# Altium schematic sheet TOP_LEVEL.SchDoc
size 594 x 420 mm; SheetNumber: 1; SheetTotal: 20
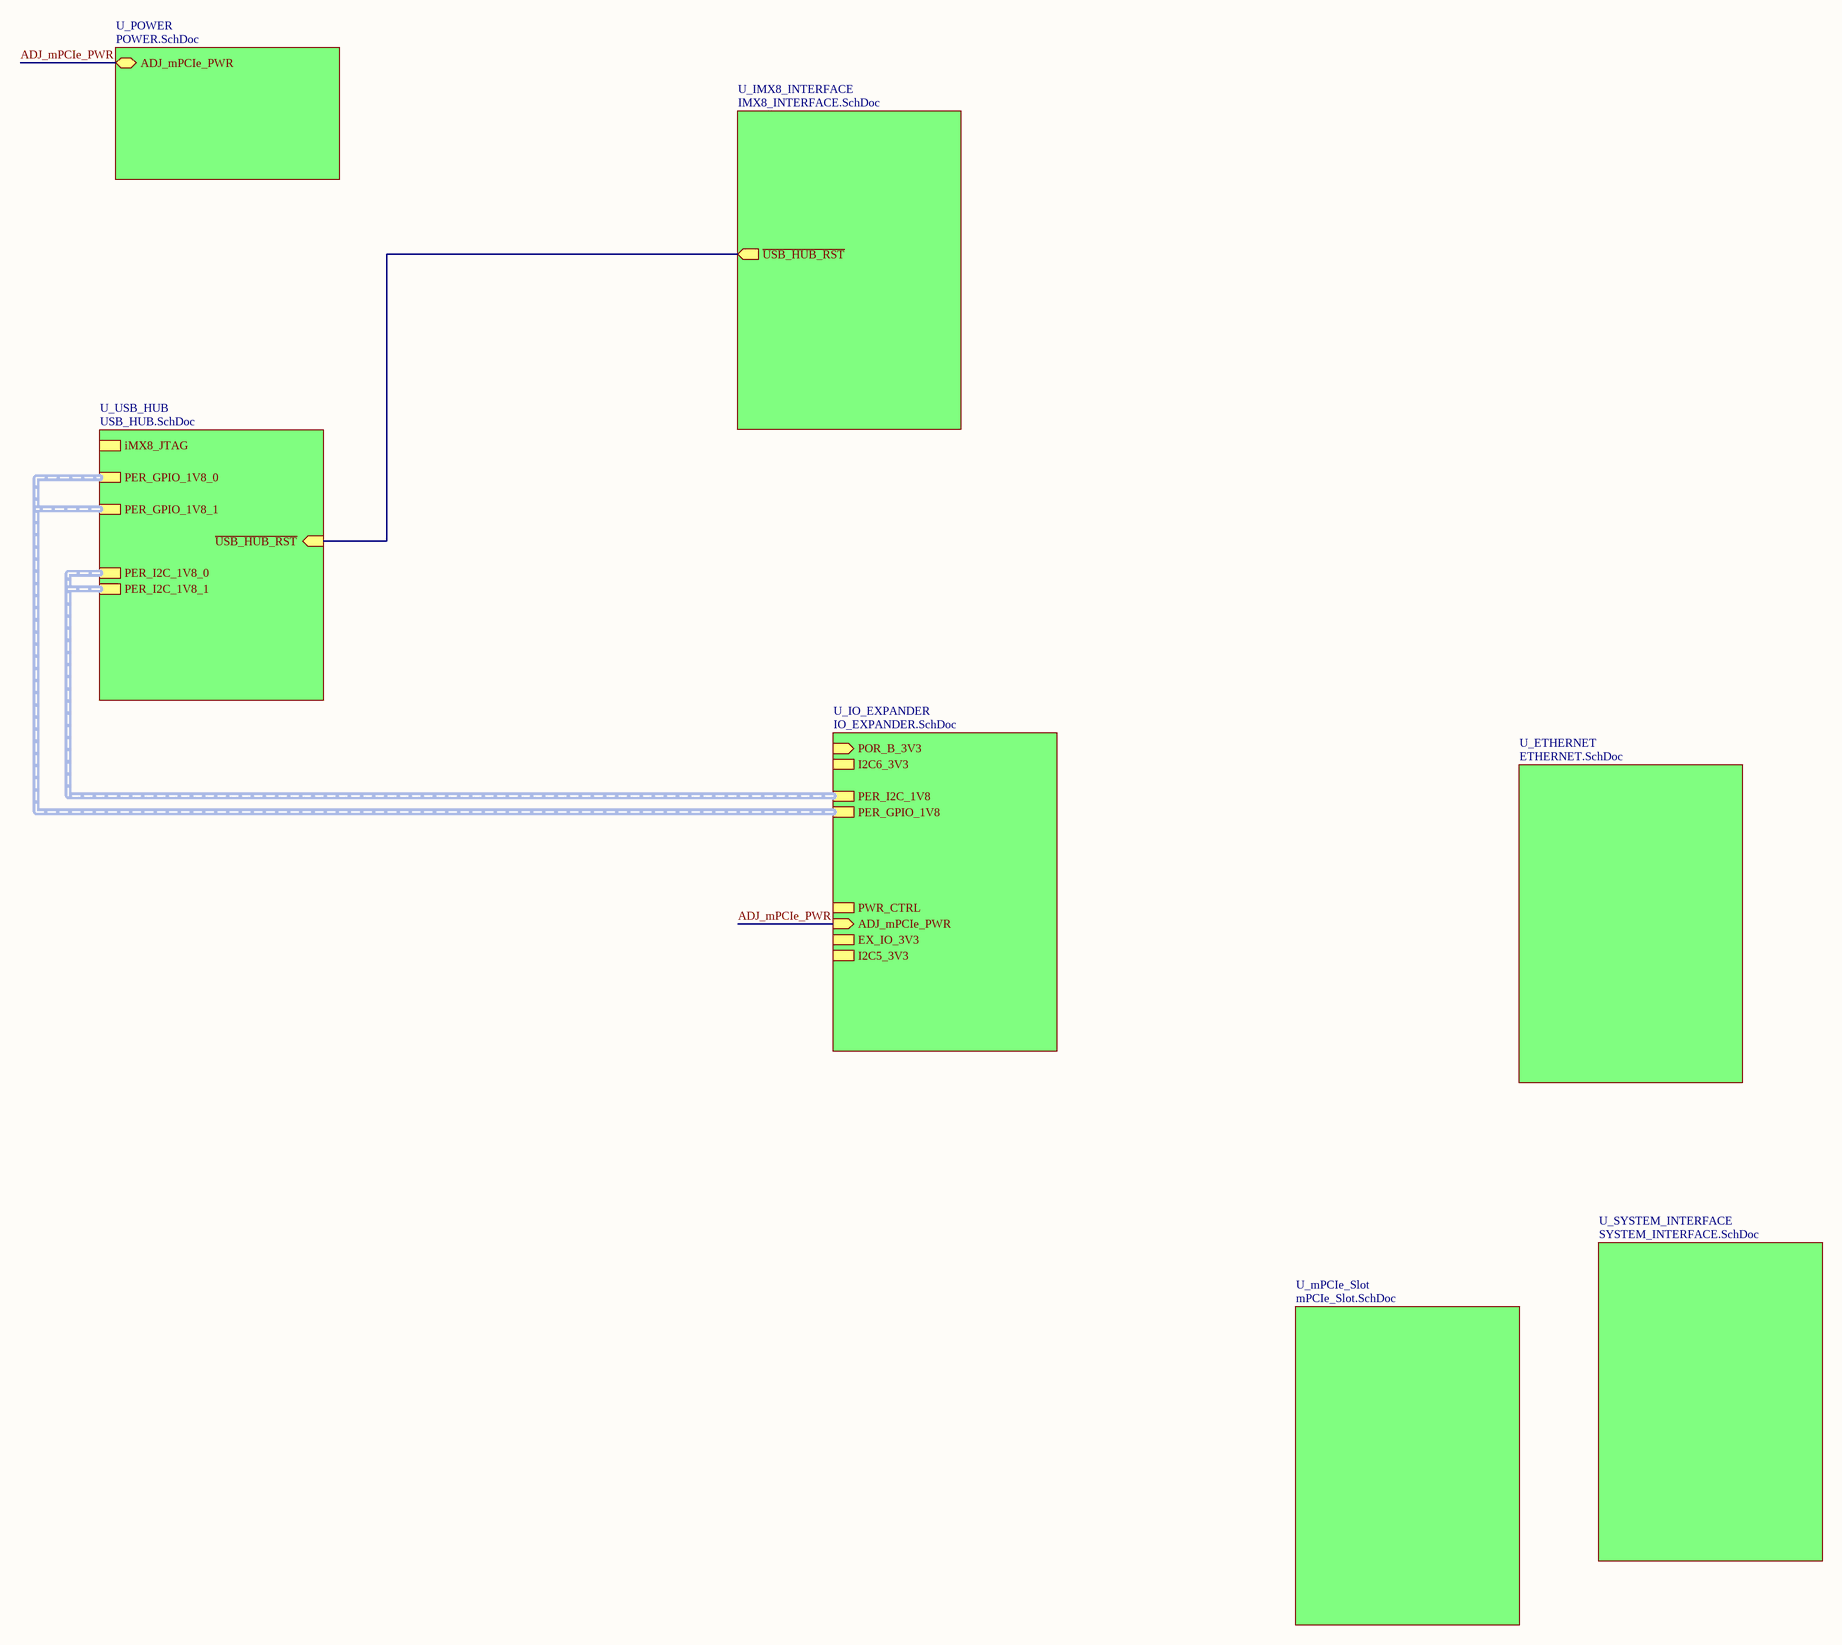
[diagram p0: TOP_LEVEL.SchDoc]

## Sub-sheets
U_ETHERNET = ETHERNET.SchDoc: no entries
U_IMX8_INTERFACE = IMX8_INTERFACE.SchDoc: ~{USB_HUB_RST} (out)
U_IO_EXPANDER = IO_EXPANDER.SchDoc: POR_B_3V3 (in), I2C6_3V3 (harness I2C6_3V3), PER_GPIO_1V8 (harness PER_GPIO_1V8), PER_I2C_1V8 (harness PER_I2C_1V8), PWR_CTRL (harness PWR_CTRL), ADJ_mPCIe_PWR (in), EX_IO_3V3 (harness EX_IO), I2C5_3V3 (harness I2C5_3V3)
U_mPCIe_Slot = mPCIe_Slot.SchDoc: no entries
U_POWER = POWER.SchDoc: ADJ_mPCIe_PWR (bidir)
U_SYSTEM_INTERFACE = SYSTEM_INTERFACE.SchDoc: no entries
U_USB_HUB = USB_HUB.SchDoc: iMX8_JTAG (harness iMX8_JTAG), PER_GPIO_1V8_0 (harness PER_GPIO_1V8_0), PER_GPIO_1V8_1 (harness PER_GPIO_1V8_1), PER_I2C_1V8_0 (harness PER_GPIO_1V8_0), PER_I2C_1V8_1 (harness PER_GPIO_1V8_1), ~{USB_HUB_RST} (in)

## Nets
ADJ_mPCIe_PWR: sheet U_POWER/ADJ_mPCIe_PWR, sheet U_IO_EXPANDER/ADJ_mPCIe_PWR
(unnamed): sheet U_IMX8_INTERFACE/~{USB_HUB_RST}, sheet U_USB_HUB/~{USB_HUB_RST}

## Buses and harness runs
harness sheet U_IO_EXPANDER/PER_GPIO_1V8 = sheet U_USB_HUB/PER_GPIO_1V8_0 = sheet U_USB_HUB/PER_GPIO_1V8_1
harness sheet U_IO_EXPANDER/PER_I2C_1V8 = sheet U_USB_HUB/PER_I2C_1V8_0 = sheet U_USB_HUB/PER_I2C_1V8_1

## Notes on the sheet
- DWG NO:
- REV:
- THIS DOCUMENT AND THE DATA DISCLOSED HEREIN OR
- HEREWITH IS THE PROPERTY OF ALTIUM LIMITED AND MAY
- BE FREELY DISTRIBUTED IN WHOLE. NO RIGHTS ARE
- RESERVED OR EXPRESS OR IMPLIED WARANTEE GIVEN.
- REVISION
- DESCRIPTION
- DATE
- APPROVED
- ENG:
- APPROVALS
- PROJECT
- DSN:
- CHK:
- REFERENCE DOCUMENTS
- PROJECT REVISION:
- TITLE
- DOCUMENT REVISION:
- DESIGN ITEM:
- BOM:
- FAB DWG:
- PCB DWG:
- ASSY DWG:
- SCALE:
- A2
- SIZE
- CAGE CODE
- FILE NAME
- DWG NO.
- SHEET
- OF
- REV